# EAGLE design AS5047P (EAGLE 9.6.2)
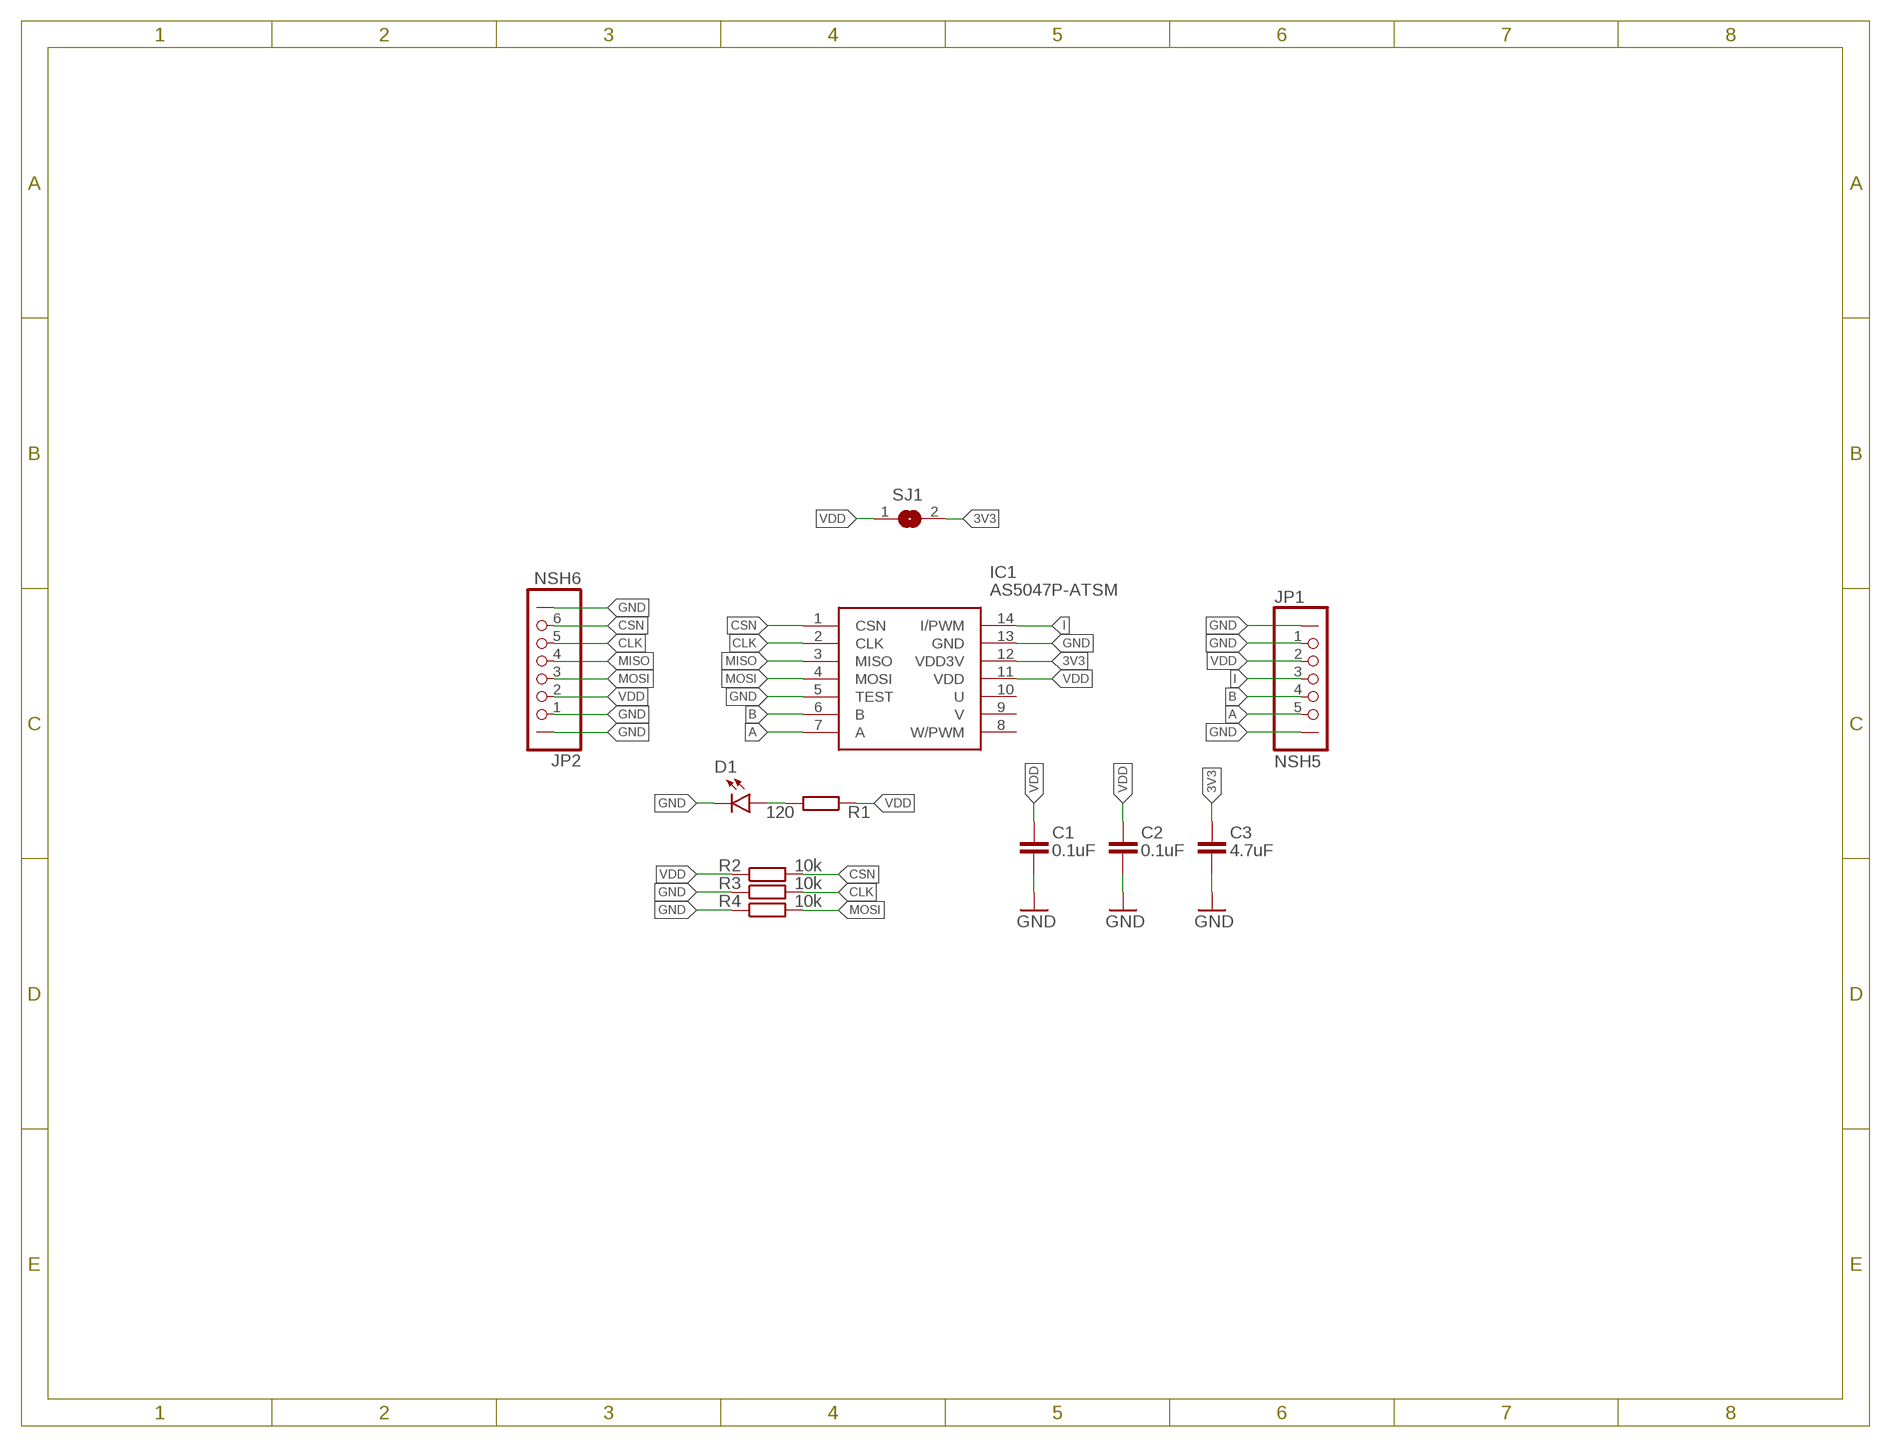
[diagram p0: schematic, sheet 1]

## Parts
C1  0.1uF  C_CHIP-0402(1005-METRIC)  [0402]
C2  0.1uF  C_CHIP-0402(1005-METRIC)  [0402]
C3  4.7uF  C_CHIP-0402(1005-METRIC)  [0402]
D1  Yellow  CHIP-FLAT-B_0402  [LEDC1005X25N_FLAT-B]
IC1  AS5047P-ATSM  [SOP65P640X120-14L]
JP1  NSH5  [NSH_5]
JP2  NSH6  [NSH_6]
R1  120  R_CHIP-0402(1005-METRIC)  [0402]
R2  10k  R_CHIP-0402(1005-METRIC)  [0402]
R3  10k  R_CHIP-0402(1005-METRIC)  [0402]
R4  10k  R_CHIP-0402(1005-METRIC)  [0402]
SJ1  SJ  [SJ]

## Nets
3V3: C3.1 IC1.12(VDD3V) SJ1.2
A: IC1.7(A) JP1.5
B: IC1.6(B) JP1.4
CLK: IC1.2(CLK) JP2.5 R3.2
CSN: IC1.1(CSN) JP2.6 R2.2
GND: C1.2 C2.2 C3.2 D1.C IC1.5(TEST) IC1.13(GND) JP1.1 JP1.P-MOUNT1 JP1.P-MOUNT2 JP2.1 JP2.P-MOUNT1 JP2.P-MOUNT2 R3.1 R4.1
I: IC1.14(I/PWM) JP1.3
LED_R: D1.A R1.2
MISO: IC1.3(MISO) JP2.4
MOSI: IC1.4(MOSI) JP2.3 R4.2
VDD: C1.1 C2.1 IC1.11(VDD) JP1.2 JP2.2 R1.1 R2.1 SJ1.1
Unconnected: IC1.8(W/PWM) IC1.9(V) IC1.10(U)

## Library data of the parts
C1-C3 = 01_SMD_RLC:C: Capacitor - Generic; CATEGORY: Capacitor
D1 = LED:CHIP-FLAT-B; CATEGORY: LED; COLOR: BLUE; DESCRIPTION: CHIP LED FLAT; JLCPCB: C72038; SUB-CATEGORY: CHIP; TYPE: FLAT_TOP; VALUE: LED_BLUE
IC1 = AS5047P-ATSM_0:AS5047P-ATSM: Board Mount Hall Effect / Magnetic Sensors 14 bit core res Up to 28krpm Source: Datasheet <https://datasheet.datasheetarchive.com/originals/distributors/DKDS-7/120640.pdf>; DESCRIPTION: Board Mount Hall Effect / Magnetic Sensors 14 bit core res Up to 28krpm; HEIGHT: 1.2mm; MANUFACTURER_NAME: ams OSRAM; MANUFACTURER_PART_NUMBER: AS5047P-ATSM; MOUSER_PART_NUMBER: 985-AS5047P-ATSM; MOUSER_PRICE-STOCK: https://www.mouser.co.uk/ProductDetail/ams-OSRAM/AS5047P-ATSM?qs=cGEy3R83DS8fzNOVLHtOgg%3D%3D
JP1 = con-jst-sh (1):NSH5
JP2 = con-jst-sh (1):NSH6
R1-R4 = 01_SMD_RLC:R: Resistor Fixed - Generic; CATEGORY: Resistor; SUB-CATEGORY: Fixed
SJ1 = jumper:SJ: SMD solder JUMPER

## Board
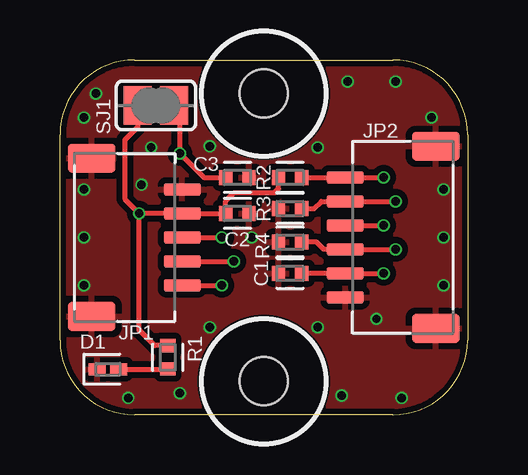
[diagram p1: board, top side]
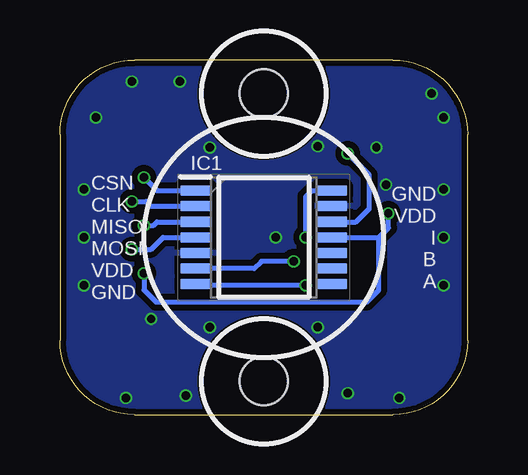
[diagram p2: board, bottom side, seen from below]

Size 17 x 14.8 mm. Coordinates in mm from the lower left corner, seen from the top.
Outline: 0,3.11 arc90 3.11,0 13.89,0 arc90 17,3.11 17,11.69 arc90 13.89,14.8 3.11,14.8 arc90 0,11.69 0,3.11
Copper layers (1*16): Top 0.035mm / dielectric 1.6mm / Bottom 0.035mm
Design rules "jlcpcb-2layers": minimum track width 5mil, minimum drill 0.3mm, track to track 6mil, track to pad 6mil, pad to pad 6mil, via to via 6mil, smd to smd 5mil, copper to edge 0.2mm, drill to drill 6mil, minimum pad ring 10mil, minimum via ring 3mil, stop-mask expansion 4mil, vias tented up to drill 15mil, thermal gap 10mil
Holes 2 mm at 8.5,1.4 8.5,13.4
tRestrict: area 6,10.9 to 11,15.9; area 6,-1.1 to 11,3.9
bRestrict: area 6,-1.1 to 11,3.9; area 6,10.9 to 11,15.9

### Footprints (pad centres in the part's own frame; a part is rotated, then mirrored left to right if it is on the bottom)
0402 = smd 0.56 x 0.629: 1 -0.485,0; 2 0.485,0
LEDC1005X25N_FLAT-B = smd 0.7 x 0.5: A 0.45,0; C -0.45,0
SOP65P640X120-14L = smd 1.25 x 0.45: 1 -2.85,1.95; 2 -2.85,1.3; 3 -2.85,0.65; 4 -2.85,0; 5 -2.85,-0.65; 6 -2.85,-1.3; 7 -2.85,-1.95; 8 2.85,-1.95; 9 2.85,-1.3; 10 2.85,-0.65; 11 2.85,0; 12 2.85,0.65; 13 2.85,1.3; 14 2.85,1.95
NSH_5 = smd 0.5 x 1.55: 1 -2,0; 2 -1,0; 3 0,0; 4 1,0; 5 2,0 | smd 1.2 x 2: P-MOUNT1 -3.3,-3.775; P-MOUNT2 3.3,-3.775
NSH_6 = smd 0.5 x 1.55: 1 -2.5,0; 2 -1.5,0; 3 -0.5,0; 4 0.5,0; 5 1.5,0; 6 2.5,0 | smd 1.2 x 2: P-MOUNT1 -3.8,-3.775; P-MOUNT2 3.8,-3.775
SJ = smd 1.168 x 1.6: 1 -0.762,0; 2 0.762,0

### Placement (x,y rotation side)
C1  9.6,5.9 180 top
C2  7.4,8.4 0 top
C3  7.4,9.9 0 top
D1  2,1.9 0 top
IC1  8.5,7.4 0 bottom
JP1  5.1,7.4 270 top
JP2  11.9,7.4 90 top
R1  4.5,2.4 270 top
R2  9.6,9.9 0 top
R3  9.6,8.6 0 top
R4  9.6,7.2 0 top
SJ1  4,12.9 0 top

### Tracks (layer width: path | path; a pad name or v marks a point on that pad's centre or on a via)
3V3  (via drill 0.35)
  Top 0.2: SJ1.2 5,12.66 v5,10.9 6,9.9 C3.1
  Bottom 0.2: IC1.12 4.65,8.05 4.1,8.6 4.1,10 v5,10.9
A  (via drill 0.35)
  Top 0.2: JP1.5 v6.75,5.4
  Bottom 0.2: v6.75,5.4 11.3,5.4 IC1.7
B  (via drill 0.35)
  Top 0.2: JP1.4 v7.25,6.4
  Bottom 0.2: v7.25,6.4 8.6,6.4 8.9,6.1 IC1.6
CLK  (via drill 0.35)
  Top 0.2: R3.2 10.6,8.6 10.9,8.9 JP2.5 v14,8.9
  Bottom 0.2: v14,8.9 13.4,8.9 13.2,8.7 IC1.2
CSN  (via drill 0.35)
  Top 0.2: R2.2 JP2.6 v13.5,9.9
  Bottom 0.2: v13.5,9.9 12.95,9.35 IC1.1
GND  (via drill 0.35)
  other vias: 8,7.4 3.4,9.6 3.8,11.15 1,5.4 1,7.4 1,9.4 16,7.4 16,9.4 16,5.4 12,13.9 14,13.9 5,0.9 2.85,0.7 1,12.4 1.5,13.4 15.5,12.4 6.25,11.2 10.75,11.15 6.25,3.65 10.75,3.65 13.2,4 11.75,0.8 14.25,0.7
  pour Top (isolate 0.254): -0.5,-0.6 17.5,-0.6 17.5,15.4 -0.5,15.4
  pour Bottom (isolate 0.254): -0.5,-0.6 17.5,-0.6 17.5,15.4 -0.5,15.4
I  (via drill 0.35)
  Top 0.2: JP1.3 v6.75,7.4
  Bottom 0.2: v6.75,7.4 6.75,9.1 6.5,9.35 IC1.14
LED_R
  Top 0.2: D1.A 4.5,1.9 R1.2
MISO  (via drill 0.35)
  Top 0.2: JP2.4 v13.5,7.9
  Bottom 0.2: v13.5,7.9 13.1,7.9 12.95,8.05 IC1.3
MOSI  (via drill 0.35)
  Top 0.2: R4.2 10.7,7.2 11,6.9 JP2.3 v14,6.9
  Bottom 0.2: v14,6.9 13.2,6.9 12.7,7.4 IC1.4
VDD  (via drill 0.35)
  Top 0.2: C1.1 JP2.2 v13.5,5.9 | 3.34,12.8 SJ1.1 3.24,12 2.7,11.46 2.7,9 v3.3,8.4 | v3.3,8.4 JP1.2 C2.1 6.92,8.92 7.26,9.27 8.95,9.27 9.12,9.43 R2.1 | R1.1 3.95,2.89 3.3,3.54 v3.3,8.4
  Bottom 0.2: v13.5,5.9 13.5,5.2 13,4.7 4.2,4.7 3.7,5.2 3.7,7.4 | IC1.11 3.7,7.4 | 3.7,7.4 3.3,7.8 v3.3,8.4

### Text on the board
bNames: GND / VDD / I / B / A | CSN / CLK / MISO / MOSI / VDD / GND